# Altium schematic sheet HAND_CAN_MCU.SchDoc
size Letter; SheetNumber: 7; SheetTotal: 15
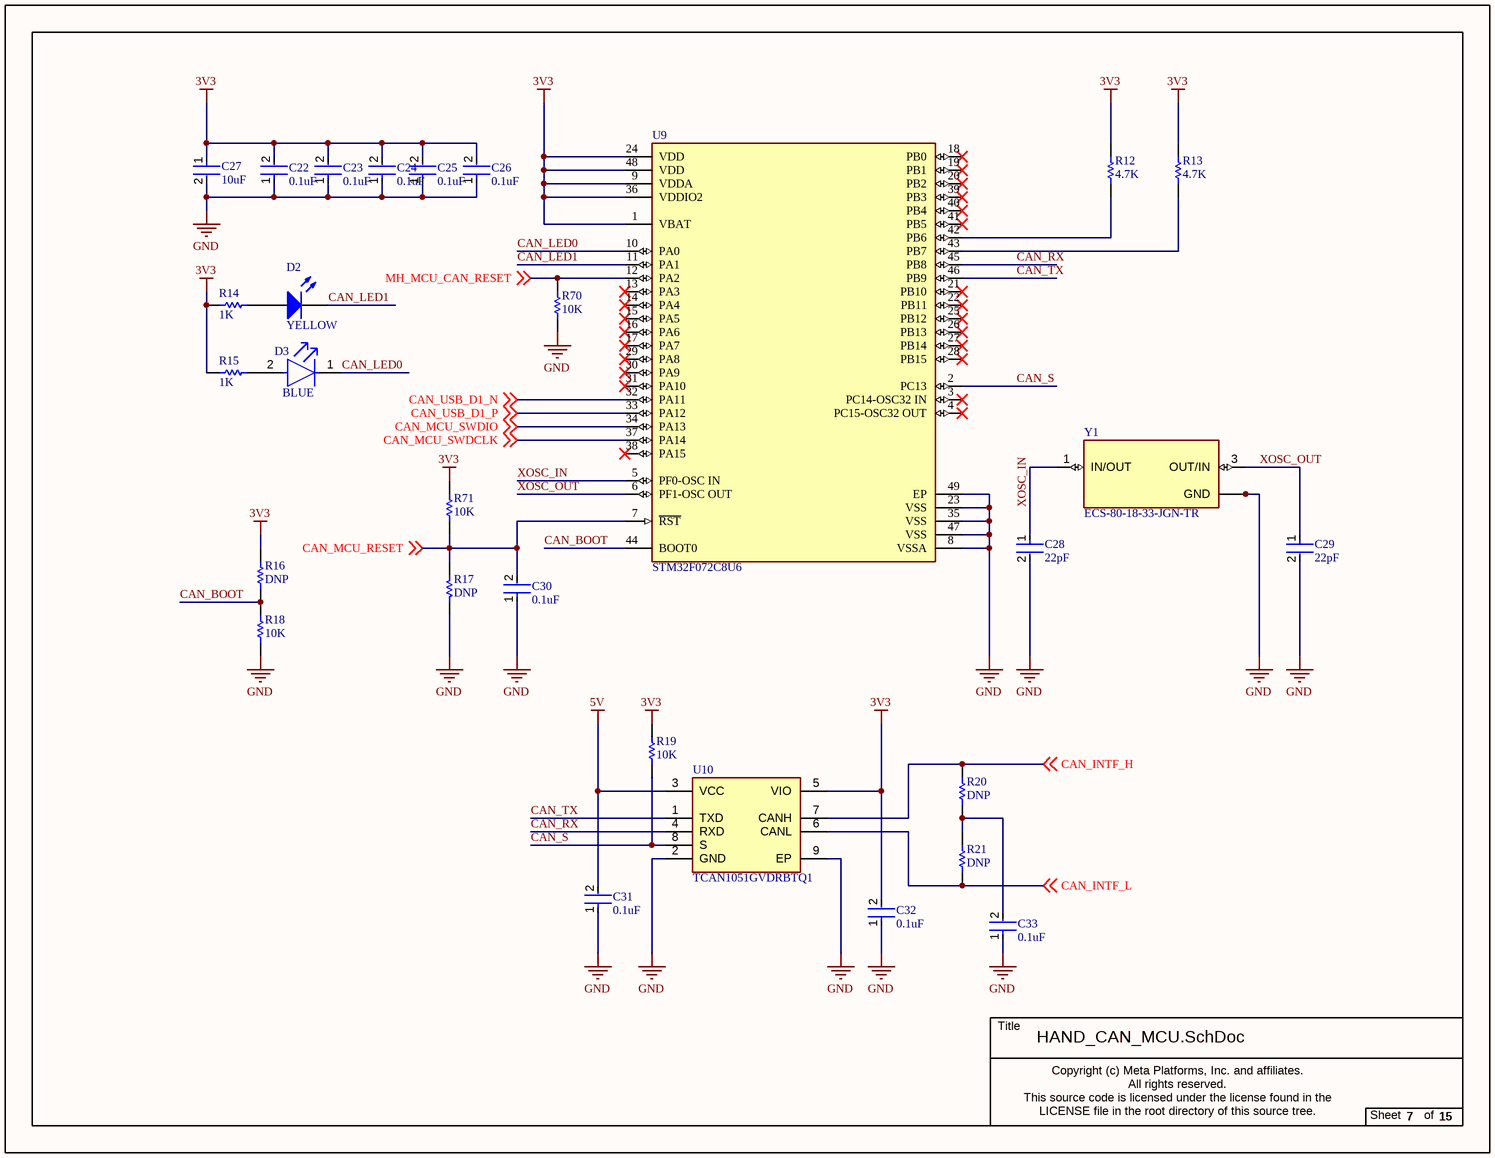
[diagram p0: HAND_CAN_MCU.SchDoc]

## Parts
C22  0.1uF  [FP-CC0201-BA-MFG]
C23  0.1uF  [FP-CC0201-BA-MFG]
C24  0.1uF  [FP-CC0201-BA-MFG]
C25  0.1uF  [FP-CC0201-BA-MFG]
C26  0.1uF  [FP-CC0201-BA-MFG]
C27  10uF  [FP-CL05A106MP5NUNC-MFG]
C28  22pF  [FP-0402-L_1_0_1-W_0_5_0_1-MFG]
C29  22pF  [FP-0402-L_1_0_1-W_0_5_0_1-MFG]
C30  0.1uF  [FP-CC0201-BA-MFG]
C31  0.1uF  [FP-CC0201-BA-MFG]
C32  0.1uF  [FP-CC0201-BA-MFG]
C33  0.1uF  [FP-CC0201-BA-MFG]
D2  YELLOW  [0603_A]
D3  BLUE  [FP-LTST-C191TBKT-MFG]
R12  4.7K  [RESC1005X40X25LL05T05]
R13  4.7K  [RESC1005X40X25LL05T05]
R14  1K  [RESC1005X40X25NL05T05]
R15  1K  [RESC1005X40X25NL05T05]
R16  DNP  [RESC1005X40X25ML05T10]
R17  DNP  [RESC1005X40X25NL05T10]
R18  10K  [RESC1005X40X25ML05T10]
R19  10K  [RESC1005X40X25ML05T10]
R20  DNP  [RESC1005X40X25ML05T10]
R21  DNP  [RESC1005X40X25ML05T10]
R70  10K  [RESC1005X40X25ML05T10]
R71  10K  [RESC1005X40X25ML05T10]
U9  STM32F072C8U6  [FP-UFQFPN48-A0B9-MFG]
U10  TCAN1051GVDRBTQ1  [SON65P300X300X100-9N-D]
Y1  ECS-80-18-33-JGN-TR  [XTAL_ECS-240-8-33-AGN-TR]

## Nets
3V3: C22.2 C23.2 C24.2 C25.2 C26.2 C27.1 C32.2 R12.2 R13.2 R14.1 R15.1 R16.2 R19.2 R71.2 U9.1(VBAT) U9.9(VDDA) U9.24(VDD) U9.36(VDDIO2) U9.48(VDD) U10.5(VIO)
5V: C31.2 U10.3(VCC)
GND: C22.1 C23.1 C24.1 C25.1 C26.1 C27.2 C28.2 C29.2 C30.1 C31.1 C32.1 C33.1 R17.1 R18.1 R70.1 U9.8(VSSA) U9.23(VSS) U9.35(VSS) U9.47(VSS) U9.49(EP) U10.2(GND) U10.9(EP) Y1.2(GND) Y1.4(GND)
CAN_BOOT: R16.1 R18.2 U9.44(BOOT0)
CAN_INTF_H: R20.2 U10.7(CANH) ; off-sheet CAN_INTF_H
CAN_INTF_L: R21.1 U10.6(CANL) ; off-sheet CAN_INTF_L
CAN_LED0: D3.1(C) U9.10(PA0)
CAN_LED1: D2.1(K) U9.11(PA1)
CAN_MCU_RESET: C30.2 R17.2 R71.1 U9.7(~{RST}) ; off-sheet CAN_MCU_RESET
CAN_MCU_SWDCLK: U9.37(PA14) ; off-sheet CAN_MCU_SWDCLK
CAN_MCU_SWDIO: U9.34(PA13) ; off-sheet CAN_MCU_SWDIO
CAN_RX: U9.45(PB8) U10.4(RXD)
CAN_S: R19.1 U9.2(PC13) U10.8(S)
CAN_TX: U9.46(PB9) U10.1(TXD)
CAN_USB_D1_N: U9.32(PA11) ; off-sheet CAN_USB_D1_N
CAN_USB_D1_P: U9.33(PA12) ; off-sheet CAN_USB_D1_P
MH_MCU_CAN_RESET: R70.2 U9.12(PA2) ; off-sheet MH_MCU_CAN_RESET
XOSC_IN: C28.1 U9.5(PF0-OSC_IN) Y1.1(IN/OUT)
XOSC_OUT: C29.1 U9.6(PF1-OSC_OUT) Y1.3(OUT/IN)
NetC33_2: C33.2 R20.1 R21.2
NetD2_2: D2.2(A) R14.2
NetD3_2: D3.2(A) R15.2
NetR12_1: R12.1 U9.42(PB6)
NetR13_1: R13.1 U9.43(PB7)

Not connected (* = marked no-connect by the designer): U9 3(PC14-OSC32_IN)* 4(PC15-OSC32_OUT)* 13(PA3)* 14(PA4)* 15(PA5)* 16(PA6)* 17(PA7)* 18(PB0)* 19(PB1)* 20(PB2)* 21(PB10)* 22(PB11)* 25(PB12)* 26(PB13)* 27(PB14)* 28(PB15)* 29(PA8)* 30(PA9)* 31(PA10)* 38(PA15)* 39(PB3)* 40(PB4)* 41(PB5)*

## Notes on the sheet
- Title
- Copyright (c) Meta Platforms, Inc. and affiliates.
  All rights reserved.
  This source code is licensed under the license found in the
  LICENSE file in the root directory of this source tree.
- Sheet
- of

## Library data of the parts
C22-C26 C30-C33 = CMP-03422-000376-1: CAP CER 0.1UF 6.3V X5R 0201; Manufacturer: Yageo; Manufacturer Part Number: CC0201KRX5R5BB104; Tolerance: 0.1; Temperature Coefficient: 15%; Value: 100 nF; Material: Ceramic; Automotive: No; Device Class L2: Capacitors; Temperature Range High: +85°C; Capacitance: 100 nF; Temperature: -55°C to +85°C; ComponentLink2URL: http://www.yageo.com/documents/recent/UPY-GPHC_X5R_4V-to-50V_25.pdf; Category: Cap; Mouser Description: Multilayer Ceramic Capacitors MLCC - SMD/SMT 100nF 6.3V X5R 10%; Ipc Land Pattern Name: CAPC6030X30; Temperature Characteristic: X5R; Voltage Rating: 6.3 V; Lead Free: Yes; Digikey Description: CAP CER 0.1UF 6.3V X5R 0201; Device Class L1: Passive Components; Octopart: https://octopart.com/cc0201krx5r5bb104-yageo-9292636; Height: 0.33mm; Package: CC0201-BA; Footprint Url: http://www.yageo.com/exep/pages/download/literatures/UPY-C_GEN_24.pdf; ComponentLink2Description: Datasheet; Device Class L3: Ceramic Capacitors; Temperature Range Low: -55°C; RoHS: TRUE
C27 = CMP-13271-000002-1: CAP CER 10UF 10V X5R 0402; Manufacturer Part Number: CL05A106MP5NUNC; Manufacturer: Samsung; Temperature Coefficient: 15%; Tolerance: 20%; Material: Ceramic; Octopart: https://octopart.com/cl05a106mp5nunc-samsung-22457395; Voltage Rating: 10V; RoHS: TRUE; Value: 10uF; Height: 0.7mm; Digikey Description: CAP CER 10UF 10V X5R 0402; Automotive: No; Package: CL05A106MP5NUNC; Device Class L1: Passive Components; Capacitance: 10uF; Temperature Range High: +85°C; ComponentLink2Description: Datasheet; Device Class L2: Capacitors; Temperature Characteristic: X5R; Temperature: -55°C to +85°C; ComponentLink2URL: http://www.samsungsem.com/kr/support/product-search/mlcc/__icsFiles/afieldfile/2019/05/10/19-CL05A106MP5NUNC.pdf; Device Class L3: Ceramic Capacitors; Category: Cap; Temperature Range Low: -55°C; Ipc Land Pattern Name: CAPC10050X50; Lead Free: Yes
C28 C29 = CMP-2008-02613-2: General Purpose Ceramic Capacitor, 0402, 22pF, 5%, C0G, 30ppm/°C, 50V; Temperature Coefficient: 30ppm/°C; Mount: Surface Mount; Length: 1mm; Construction: Flat; Contact Plating: Tin; REACH SVHC: No SVHC; Case/Package: 0402; Voltage: 50V; Case Code (Imperial): 0402; Thickness: 0.022inch; Radiation Hardening: No; Number of Pins: 2; Tolerance: 5%; Max Operating Temperature: 125°C; RoHS Compliant: Yes; Voltage Rating: 50V; Case Code (Metric): 1005; Package Quantity: 1; Width: 0.02inch; Termination: SMD/SMT; Lead Free: Lead Free; Height: 0.5mm; Voltage Rating (DC): 50V; Capacitance: 22pF; Min Operating Temperature: -55°C; Series: -; Depth: 0.5mm; Dielectric: C0G; Packaging: Tape and Reel
D2 = CMP-1426-00005-1: SMD mono-color Chip LED, WL-SMCW, Yellow; PartNumber: 150060YS75000; Manufacturer: Wuerth Elektronik; ComponentLink1URL: http://www.we-online.com; Color: Yellow; ComponentLink2Description: Datasheet; ComponentLink2URL: http://katalog.we-online.com/led/datasheet/150060YS75000.pdf; ComponentLink1Description: Manufacturer URL; PackageReference: 0603_A
D3 = CMP-22017-000008-1: LED BLUE CLEAR CHIP SMD; Lens Color: Colorless; Dominant Wavelength: 475nm; Forward Current: 20mA; Wavelength: 468nm; Viewing Angle: 130°; Power Dissipation: 76mW; Luminous Intensity: 180mcd; Reverse Voltage: 5V; Number of Elements: 1; Lens Style: Diffused; Forward Voltage: 3.8V; Max Power Dissipation: 75mW; Case Code (Metric): 1608; Packaging: Tape and Reel; Case/Package: 0603; Depth: 1.6mm; Mount: Surface Mount; Lead Free: Lead Free; Min Operating Temperature: -20°C; Lens Transparency: Clear; Illumination Color: Blue; Height: 0.55mm; Test Current: 20mA; Case Code (Imperial): 0603; Max Operating Temperature: 80°C; Number of Pins: 2; Length: 0.8mm; Radiation Hardening: No; Package Quantity: 1; Number of LEDs: 1; Width: 0.8mm; Color: Blue
R12 R13 = CMP-2002-01154-4: Chip Resistor, 4.7 KOhm, +/- 1%, 0.1 W, -55 to 155 degC, 0402 (1005 Metric), RoHS, Tape and Reel; PartNumber: ERJ-2RKF4701X; Voltage Rating: 50 V; Case\/Package: 0402; Power Rating: 100 mW; Height: 0.35 mm; Mounting Technology: Surface Mount; REACH SVHC: Yes; Resistance: 4.7 KOhm; Max Operating Temperature: 155 degC; ComponentLink1Description: Manufacturer URL; ComponentLink2Description: Datasheet; Pins: 2; PackageReference: 0402; Tolerance: 1%; Case Code (Imperial): 0402; Length: 1 mm; PackageDescription: 2-Pin Surface Mount Device, Body 1 x 0.5 mm; RoHSCompliant: true; Package Quantity: 1; Radiation Hardening: No; DatasheetVersion: 04/2015; Width: 0.5 mm; Case Code (Metric): 1005; Mount: Surface Mount; ComponentLink1URL: http://www.panasonic.com/; Min Operating Temperature: -55 degC; Packaging: Cut Tape; ComponentLink2URL: http://industrial.panasonic.com/cdbs/www-data/pdf/RDA0000/AOA0000C86.pdf
R14 R15 = CMP-1011-00510-4: Chip Resistor, 1 KOhm, +/- 1%, 100 mW, -55 to 155 degC, 0402 (1005 Metric), RoHS, Tape and Reel; PartNumber: ERJ-2RKF1001X; Manufacturer: Basic Passives; Voltage Rating: 50 V; Case\/Package: 0402; Resistance: 1 KOhm; Power Rating: 100 mW; DatasheetVersion: 04/2015; Radiation Hardening: No; Pins: 2; Height: 0.35 mm; RoHSCompliant: true; Case Code (Imperial): 0402; ComponentLink2Description: Datasheet; ComponentLink1Description: Manufacturer URL; PackageReference: 0402; Mount: Surface Mount; Package Quantity: 10000; Tolerance: 1%; ComponentLink1URL: http://www.panasonic.com/; PackageDescription: 2-Pin Surface Mount Device, Body 1 x 0.5 mm; Mounting Technology: Surface Mount; Case Code (Metric): 1005; ComponentLink2URL: http://industrial.panasonic.com/cdbs/www-data/pdf/RDA0000/AOA0000C86.pdf; REACH SVHC: Yes; Packaging: Tape and Reel; Max Operating Temperature: 155 degC; Min Operating Temperature: -55 degC; Width: 0.5 mm; Length: 1 mm
R16 R18-R21 R70 R71 = CMP-2002-03043-1: Part Number: CRCW040210K0FKEDHP; Manufacturer: Vishay Dale
R17 = CMP-1011-00001-2: Manufacturer: Yageo / Phycomp; Part Number: RC0402JR-070RL
U9 = CMP-0304-00167-3: IC MCU 32BIT 64KB FLASH 48UFQFPN; Max Supply Voltage: 3.6V; RAM Size: 16KB; Oscillator Type: Internal; Watchdog Timer: Yes; Max Power Dissipation: 625mW; Number of I/Os: 37; Data Bus Width: 32b; Peripherals: POR; Number of ADC Channels: 13; Interface: I2C; Number of Timers/Counters: 9; Core Architecture: ARM; Min Supply Voltage: 2V; Frequency: 48MHz; RoHS Compliant: Yes; Case/Package: UFQFPN; Min Operating Temperature: -40°C; Memory Size: 64KB; Memory Type: FLASH; Number of Pins: 48; Max Operating Temperature: 85°C; Packaging: Tray; Number of Programmable I/O: 37; Package Quantity: 1560; Lead Free: Lead Free; Max Frequency: 48MHz
U10 = TCAN1051GVDRBTQ1: Integrated Circuit; Manufacturer_Name: Texas Instruments; Datasheet Link: http://www.ti.com/lit/gpn/tcan1051gv-q1; Height: 1mm; Manufacturer_Part_Number: TCAN1051GVDRBTQ1; Mouser Part Number: 595-TCAN1051GVDRBTQ1; Mouser Price/Stock: https://www.mouser.co.uk/ProductDetail/Texas-Instruments/TCAN1051GVDRBTQ1?qs=HXFqYaX1Q2wS4ATjga%252BGjQ%3D%3D; Arrow Part Number: TCAN1051GVDRBTQ1; Arrow Price/Stock: https://www.arrow.com/en/products/tcan1051gvdrbtq1/texas-instruments?region=nac
Y1 = ECS-80-18-33-JGN-TR: The sub miniature ECX-32 is a compact SMD Crystal. The 3.2 x 2.5 x 0.8 mm ceramic package is ideal for todayâ€™s SMD manufacturing environment.; MF: {'manufacturer': u'ECS Inc.'}; Price: None; Value: *; Package: None; Availability: Unavailable; MP: ECS-80-18-33-JGN-TR